# EAGLE schematic BLDC driver board 4 layer (EAGLE 6.3)
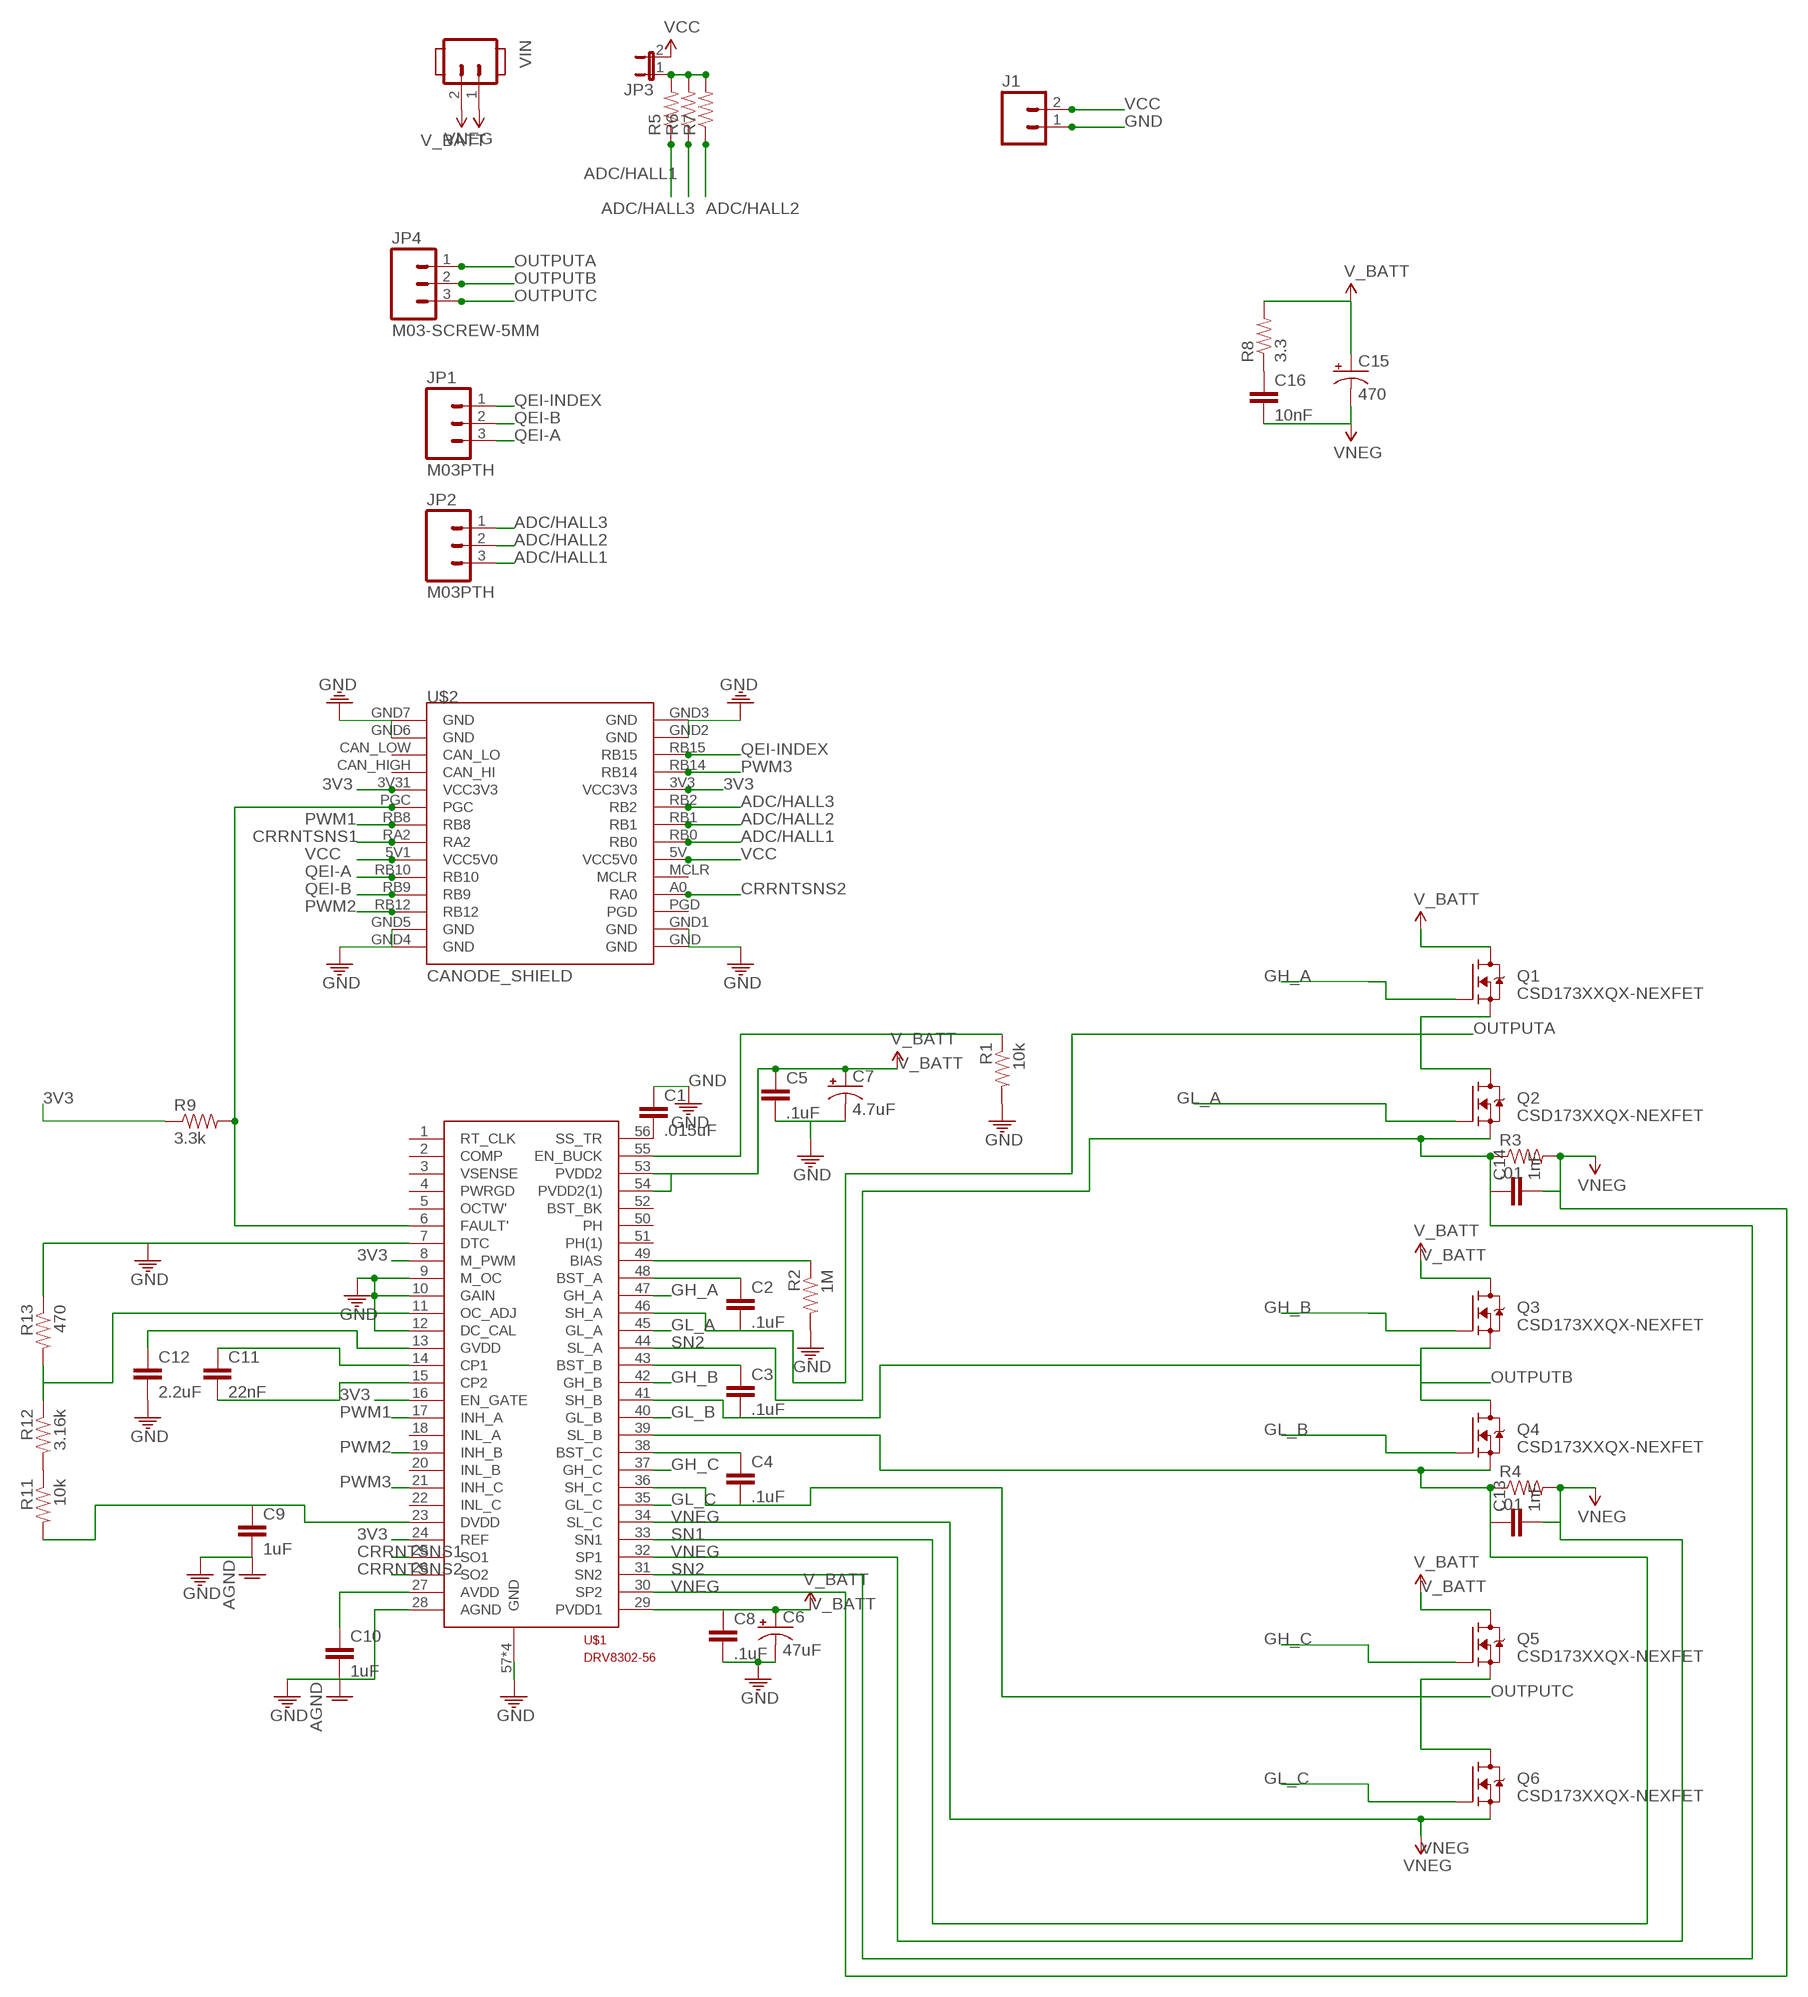
[diagram p0: schematic, sheet 1]

## Parts
C1  .015uF  CAP1206  [1206]
C2  .1uF  CAP1206  [1206]
C3  .1uF  CAP1206  [1206]
C4  .1uF  CAP1206  [1206]
C5  .1uF  CAP1206  [1206]
C6  47uF  CAP_POL  [CPOL-RADIAL-6.3MM]
C7  4.7uF  CAP_POLYO  [CPOL-RADIA-5MM]
C8  .1uF  CAP1206  [1206]
C9  1uF  CAP1206  [1206]
C10  1uF  CAP1206  [1206]
C11  22nF  CAP1206  [1206]
C12  2.2uF  CAP1206  [1206]
C13  1nF  CAP1206  [1206]
C14  1nF  CAP1206  [1206]
C15  470  CAP_POLPTH3  [CPOL-RADIAL-1000UF-63V]
C16  10nF  CAP1206  [1206]
J1  M02  [SOCKET-MALE-2.54MM-2]
JP1  M03PTH  [1X03]
JP2  M03PTH  [1X03]
JP3  JP1E  [JP1]
JP4  M03-SCREW-5MM  [SCREWTERMINAL-5MM-3]
Q1  CSD173XXQX-NEXFET  [CSD173XXQX]
Q2  CSD173XXQX-NEXFET  [CSD173XXQX]
Q3  CSD173XXQX-NEXFET  [CSD173XXQX]
Q4  CSD173XXQX-NEXFET  [CSD173XXQX]
Q5  CSD173XXQX-NEXFET  [CSD173XXQX]
Q6  CSD173XXQX-NEXFET  [CSD173XXQX]
R1  10k  RESISTOR0805-RES  [0805]
R2  1M  RESISTOR0805-RES  [0805]
R3  .01  RESISTOR  [SMT-REF]
R4  .01  RESISTOR  [SMT-REF]
R5  RESISTOR0805-RES  [0805]
R6  RESISTOR0805-RES  [0805]
R7  RESISTOR0805-RES  [0805]
R8  3.3  RESISTOR1206  [1206]
R9  3.3k  RESISTOR0805-RES  [0805]
R11  10k  RESISTOR0805-RES  [0805]
R12  3.16k  RESISTOR0805-RES  [0805]
R13  470  RESISTOR0805-RES  [0805]
U$1  DRV8302-56  [HTSSOP56]
U$2  CANODE_SHIELD  [CANODE_SHIELD]
VIN  SCREWTERM02  [SCREW_TERMINAL-5.08MM-2]

## Nets
3V3: R9.1 U$1.8(M_PWM) U$1.16(EN_GATE) U$1.24(REF) U$2.3V3(VCC3V3) U$2.3V31(VCC3V3)
ADC/HALL1: JP2.3 R6.1 U$2.RB0
ADC/HALL2: JP2.2 R7.1 U$2.RB1
ADC/HALL3: JP2.1 R5.1 U$2.RB2
CRRNTSNS1: U$1.25(SO1) U$2.RA2
CRRNTSNS2: U$1.26(SO2) U$2.A0(RA0)
GH_A: Q1.G U$1.47(GH_A)
GH_B: Q3.G U$1.42(GH_B)
GH_C: Q5.G U$1.37(GH_C)
GL_A: Q2.G U$1.45(GL_A)
GL_B: Q4.G U$1.40(GL_B)
GL_C: Q6.G U$1.35(GL_C)
GND: C1.1 C5.2 C6.2(-) C7.2(-) C8.2 C9.2 C10.2 C12.2 J1.1 R1.2 R2.2 R13.1 U$1.7(DTC) U$1.9(M_OC) U$1.10(GAIN) U$1.12(DC_CAL) U$1.28(AGND) U$1.57(GND) U$1.P$1(GND) U$1.P$2(GND) U$1.P$3(GND) U$2.GND U$2.GND1(GND) U$2.GND2(GND) U$2.GND3(GND) U$2.GND4(GND) U$2.GND5(GND) U$2.GND6(GND) U$2.GND7(GND) ; supply symbol labelled AGND
N$1: C1.2 U$1.56(SS_TR)
N$2: R9.2 U$1.6(FAULT') U$2.PGC
N$3: R2.1 U$1.49(BIAS)
N$4: C2.1 U$1.48(BST_A)
N$6: C3.1 U$1.43(BST_B)
N$7: C16.1 R8.1
N$8: C4.1 U$1.38(BST_C)
N$9: R11.1 R12.2
N$10: R1.1 U$1.55(EN_BUCK)
N$12: R12.1 R13.2 U$1.11(OC_ADJ)
N$13: JP3.1 R5.2 R6.2 R7.2
N$16: C10.1 U$1.27(AVDD)
N$18: C9.1 R11.2 U$1.23(DVDD)
N$19: C11.1 U$1.14(CP1)
N$20: C11.2 U$1.15(CP2)
N$21: C12.1 U$1.13(GVDD)
OUTPUTA: C2.2 JP4.1 Q1.S1(S) Q1.S2(S) Q1.S3(S) Q2.D Q2.P$1(D) Q2.P$2(D) Q2.P$3(D) Q2.P$4(D) Q2.P$5(D) Q2.P$6(D) Q2.P$7(D) Q2.P$8(D) Q2.P$9(D) U$1.46(SH_A)
OUTPUTB: C3.2 JP4.2 Q3.S1(S) Q3.S2(S) Q3.S3(S) Q4.D Q4.P$1(D) Q4.P$2(D) Q4.P$3(D) Q4.P$4(D) Q4.P$5(D) Q4.P$6(D) Q4.P$7(D) Q4.P$8(D) Q4.P$9(D) U$1.41(SH_B)
OUTPUTC: C4.2 JP4.3 Q5.S1(S) Q5.S2(S) Q5.S3(S) Q6.D Q6.P$1(D) Q6.P$2(D) Q6.P$3(D) Q6.P$4(D) Q6.P$5(D) Q6.P$6(D) Q6.P$7(D) Q6.P$8(D) Q6.P$9(D) U$1.36(SH_C)
PWM1: U$1.17(INH_A) U$2.RB8
PWM2: U$1.19(INH_B) U$2.RB12
PWM3: U$1.21(INH_C) U$2.RB14
QEI-A: JP1.3 U$2.RB10
QEI-B: JP1.2 U$2.RB9
QEI-INDEX: JP1.1 U$2.RB15
SN1: C13.1 Q4.S1(S) Q4.S2(S) Q4.S3(S) R4.1 R4.P$7 R4.P$8 R4.P$9 R4.P$10 R4.P$11 R4.P$12 U$1.33(SN1) U$1.39(SL_B)
SN2: C14.1 Q2.S1(S) Q2.S2(S) Q2.S3(S) R3.1 R3.P$7 R3.P$8 R3.P$9 R3.P$10 R3.P$11 R3.P$12 U$1.31(SN2) U$1.44(SL_A)
V_BATT: C5.1 C6.1(+) C7.1(+) C8.1 C15.1(+) Q1.D Q1.P$1(D) Q1.P$2(D) Q1.P$3(D) Q1.P$4(D) Q1.P$5(D) Q1.P$6(D) Q1.P$7(D) Q1.P$8(D) Q1.P$9(D) Q3.D Q3.P$1(D) Q3.P$2(D) Q3.P$3(D) Q3.P$4(D) Q3.P$5(D) Q3.P$6(D) Q3.P$7(D) Q3.P$8(D) Q3.P$9(D) Q5.D Q5.P$1(D) Q5.P$2(D) Q5.P$3(D) Q5.P$4(D) Q5.P$5(D) Q5.P$6(D) Q5.P$7(D) Q5.P$8(D) Q5.P$9(D) R8.2 U$1.29(PVDD1) U$1.53(PVDD2) U$1.54(PVDD2(1)) VIN.1
VCC: J1.2 JP3.2 U$2.5V1(VCC5V0) U$2.5V(VCC5V0)
VNEG: C13.2 C14.2 C15.2(-) C16.2 Q6.S1(S) Q6.S2(S) Q6.S3(S) R3.2 R3.P$1 R3.P$2 R3.P$3 R3.P$4 R3.P$5 R3.P$6 R4.2 R4.P$1 R4.P$2 R4.P$3 R4.P$4 R4.P$5 R4.P$6 U$1.30(SP2) U$1.32(SP1) U$1.34(SL_C) VIN.2
Unconnected: U$1.1(RT_CLK) U$1.2(COMP) U$1.3(VSENSE) U$1.4(PWRGD) U$1.5(OCTW') U$1.18(INL_A) U$1.20(INL_B) U$1.22(INL_C) U$1.50(PH) U$1.51(PH(1)) U$1.52(BST_BK) U$2.CAN_HIGH(CAN_HI) U$2.CAN_LOW(CAN_LO) U$2.MCLR U$2.PGD

## Library data of the parts
C1-C5 C8-C14 C16 = ASL:CAP: Capacitor Standard 0603 ceramic capacitor, and 0.1" leaded capacitor.
C6 C7 = pavlo:CAP_POL: Capacitor Polarized These are standard SMD and PTH capacitors. Normally 10uF, 47uF, and 100uF in electrolytic and tantalum varieties. Always verify the external diameter of the through hole cap, it varies with capacity, voltage, and manufacturer. The EIA devices should be standard.
C15 = ASL:CAP_POL: Capacitor Polarized These are standard SMD and PTH capacitors. Normally 10uF, 47uF, and 100uF in electrolytic and tantalum varieties. Always verify the external diameter of the through hole cap, it varies with capacity, voltage, and manufacturer. The EIA devices should be standard.
J1 = ASL:M02: Header 2 Standard 2-pin 0.1" header. Use with straight break away headers (SKU : PRT-00116), right angle break away headers (PRT-00553), swiss pins (PRT-00743), machine pins (PRT-00117), and female headers (PRT-00115). Molex polarized connector foot print use with SKU : PRT-08233 with associated crimp pins and housings.
JP1 JP2 JP4 = ASL:M03: Header 3 Standard 3-pin 0.1" header. Use with straight break away headers (SKU : PRT-00116), right angle break away headers (PRT-00553), swiss pins (PRT-00743), machine pins (PRT-00117), and female headers (PRT-00115). Molex polarized connector foot print use with SKU : PRT-08232 with associated crimp pins and housings.
JP3 = jumper:JP1E: JUMPER
Q1-Q6 = pavlo:CSD173XXQX
R1 R2 R5-R7 R9 R11-R13 = ASL:RESISTOR: Resistor Basic schematic elements and footprints for 0603, 1206, and PTH resistors.
R3 R4 = pavlo:RESISTOR: Resistor Basic schematic elements and footprints for 0603, 1206, and PTH resistors.
R8 = CMPE118lib:RESISTOR: Resistor Basic schematic elements and footprints for 0603, 1206, and PTH resistors.
U$1 = pavlo:DRV8302-56
U$2 = ASL:CANODE_SHIELD: This part provides an outline of the CANode to facilitate developing shield boards. Note that this does not show the position of the mounting holes for the 4-40 screws, which should be .12" holes centered in the 4 circles in the corners.
VIN = CMPE118lib:SCREWTERM02

## Net classes
0 VBATT: clearance 0.508 mm
1 V_NEG: clearance 0.508 mm